# Altium schematic sheet Inverter.SchDoc
size A4
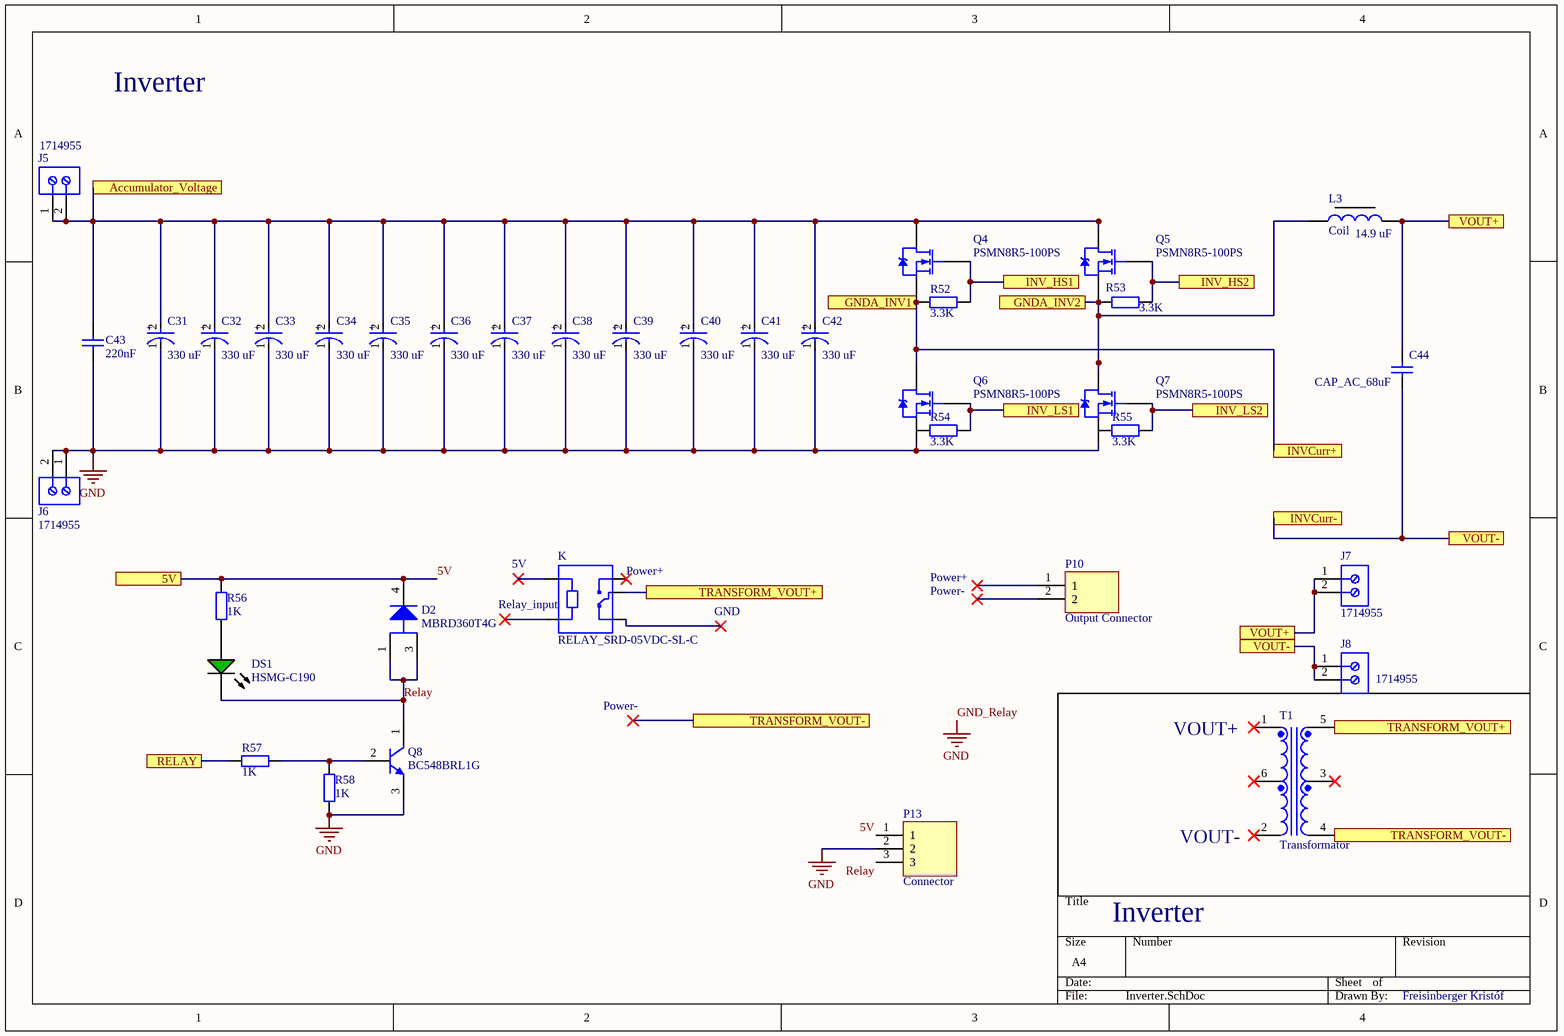
[diagram p0: Inverter.SchDoc]

## Parts
C31  330 uF  [FP-LXW18X25-MFG]
C32  330 uF  [FP-LXW18X25-MFG]
C33  330 uF  [FP-LXW18X25-MFG]
C34  330 uF  [FP-LXW18X25-MFG]
C35  330 uF  [FP-LXW18X25-MFG]
C36  330 uF  [FP-LXW18X25-MFG]
C37  330 uF  [FP-LXW18X25-MFG]
C38  330 uF  [FP-LXW18X25-MFG]
C39  330 uF  [FP-LXW18X25-MFG]
C40  330 uF  [FP-LXW18X25-MFG]
C41  330 uF  [FP-LXW18X25-MFG]
C42  330 uF  [FP-LXW18X25-MFG]
C43  220nF  [FP_0805_CAP_085]
C44  CAP_AC_68uF  [Capacitor_AC_68_uF]
D2  MBRD360T4G  [ONSC-DPAK-3-369C-01_V]
DS1  HSMG-C190  [AVAG-HSMX-C190_V]
J5  1714955  [Terminal-PHOE-1714955_V]
J6  1714955  [Terminal-PHOE-1714955_V]
J7  1714955  [Terminal-PHOE-1714955_V]
J8  1714955  [Terminal-PHOE-1714955_V]
K  RELAY_SRD-05VDC-SL-C  [FP_CONN3_2MM_90]
L3  Coil  value 14.9 uF  [Tekercs_E65_FERRITE]
P10  Output Connector  [FP_CONN2_TAP_254MM]
P13  Connector  [FP_CONN3_TAP_254MM]
Q4  PSMN8R5-100PS  [FP-TO-220AB-MFG]
Q5  PSMN8R5-100PS  [FP-TO-220AB-MFG]
Q6  PSMN8R5-100PS  [FP-TO-220AB-MFG]
Q7  PSMN8R5-100PS  [FP-TO-220AB-MFG]
Q8  BC548BRL1G  [ONSC-TO-92-3-29-11_AM_BL]
R52  3.3K  [FP_0603_RES]
R53  3.3K  [FP_0603_RES]
R54  3.3K  [FP_0603_RES]
R55  3.3K  [FP_0603_RES]
R56  1K  [FP_0603_RES]
R57  1K  [FP_0603_RES]
R58  1K  [FP_0603_RES]
T1  Transformator  [TDK-ALT3232_V]

## Ports
5V, Accumulator_Voltage, GNDA_INV1, GNDA_INV2, INV_HS1, INV_HS2, INV_LS1, INV_LS2, INVCurr+, INVCurr-, RELAY, TRANSFORM_VOUT+, TRANSFORM_VOUT-, VOUT+, VOUT-

## Nets
GND_Relay: C31.1(C) C32.1(C) C33.1(C) C34.1(C) C35.1(C) C36.1(C) C37.1(C) C38.1(C) C39.1(C) C40.1(C) C41.1(C) C42.1(C) C43.1 J6.1 J6.2 P13.2 Q6.3(S) Q7.3(S) Q8.3(E) R58.1  [also labelled GND]
5V: D2.4(K) P13.1 R56.2 ; port 5V
Accumulator_Voltage: C31.2(A) C32.2(A) C33.2(A) C34.2(A) C35.2(A) C36.2(A) C37.2(A) C38.2(A) C39.2(A) C40.2(A) C41.2(A) C42.2(A) C43.2 J5.1 J5.2 Q4.2(D) Q5.2(D) ; port Accumulator_Voltage
GNDA_INV1: Q4.3(S) Q6.2(D) R52.1 ; port INVCurr+, port GNDA_INV1
GNDA_INV2: L3.1(In) Q5.3(S) Q7.2(D) R53.1 ; port GNDA_INV2
INV_HS1: Q4.1(G) R52.2 ; port INV_HS1
INV_HS2: Q5.1(G) R53.2 ; port INV_HS2
INV_LS1: Q6.1(G) R54.2 ; port INV_LS1
INV_LS2: Q7.1(G) R55.2 ; port INV_LS2
INVCurr-: C44.1 J8.1 J8.2 ; port VOUT-, port INVCurr-
Relay: D2.1(A) D2.3(A) DS1.2(K) P13.3 Q8.1(C)
RELAY: R57.1 ; port RELAY  [a separate net that carries the same name]
TRANSFORM_VOUT+: K.COM T1.5 ; port TRANSFORM_VOUT+
TRANSFORM_VOUT-: T1.4 ; port TRANSFORM_VOUT-
VOUT+: C44.2 J7.1 J7.2 L3.2(Out) ; port VOUT+
NetDS1_1: DS1.1(A) R56.1
NetQ8_2: Q8.2(B) R57.2 R58.2

Not connected (* = marked no-connect by the designer): K A1* A2* NC* NO*; P10 1* 2*; R54 1; R55 1; T1 1* 2* 3* 6*

## Notes on the sheet
- Inverter
- (near K) 5V
- (near K) Power+
- Power+
- (near K) Relay_input
- GND
- Power-
- VOUT+
- (near T1) VOUT-
- Freisinberger Kristóf
- (in symbol CMP-35376-000008-1) +

## Library data of the parts
C31-C42 = CMP-35376-000008-1: CAP ALUM 47UF 20% 500V THRUHOLE / 500LXW47MEFR18X25
C43 = CAP: Capacitor; Value: 220nF
C44 = CAP_AC_68uF: Cap Film 68uF 100V PET 10% (31.5 X 22 X 36.5mm) Radial 27.5mm 125C Bulk; Manufacturer: TDK EPCOS; Manufacturer Part Number: B32524Q1686K000; Dielectric Material: Polyester; Lead Diameter: 0.8mm; Supplier 1: Digi-Key; RoHS: Yes; Category: Film Capacitors; Stock 1: 15; Pricing 1: 1=16,57000, 10=15,74200, 50=13,25680, 100=12,42830, 500=11,01972, 1000=10,35688 (USD); Case/Package: Radial; Min Operating Temperature: -55°C; Max Operating Temperature: 125°C; Capacitance: 68uF; Tolerance: 10%; Packaging: Bulk; Dielectric: PET; Voltage Rating (DC): 100V; Voltage Rating: 100V; Length: 31.5mm; Lead Pitch: 27.5mm; Depth: 22mm; REACH SVHC: No SVHC; RoHS Compliant: Yes; ComponentLink1URL: http://www.farnell.com/datasheets/1955213.pdf?src-supplier=Farnell; ComponentLink1Description: http://www.farnell.com/datasheets/1955213.pdf?src-supplier=Farnell; ComponentLink2URL: http://components.arrow.com/part/dataview/0323_01924821?src-supplier=Arrow+Europe; ComponentLink2Description: http://components.arrow.com/part/dataview/0323_01924821?src-supplier=Arrow+Europe; ComponentLink3URL: https://www.tdk-electronics.tdk.com/inf/20/20/db/fc_2009/B32520_529.pdf?src-supplier=Digi-Key; ComponentLink3Description: https://www.tdk-electronics.tdk.com/inf/20/20/db/fc_2009/B32520_529.pdf?src-supplier=Digi-Key; ComponentLink4URL: http://www.farnell.com/datasheets/1955213.pdf?src-supplier=Element14; ComponentLink4Description: http://www.farnell.com/datasheets/1955213.pdf?src-supplier=Element14
D2 = CMP-1055-00192-1: SWITCHMODE(TM) Power Rectifier, 3-Pin DPAK, Pb-Free, Tape and Reel; Manufacturer: On Semiconductor; Configuration: Single; IFSM Max (A): 75; Mounting Technology: Surface Mount; ComponentLink2Description: Datasheet; ComponentLink3URL: http://www.onsemi.cn/pub_link/Collateral/369C.PDF; DatasheetVersion: Rev. 8; ComponentLink2URL: http://www.onsemi.com/pub_link/Collateral/MBRD320-D.PDF; PackageDescription: 3-Pin Flange Mount, Body 6.54 x 6.095 mm, Pitch 2.29 mm; ComponentLink1URL: http://www.onsemi.com/; Packing: Tape and Reel; RoHS: TRUE; ComponentLink1Description: Manufacturer URL; ComponentLink3Description: Package Specification; PackageVersion: Rev. E, 02/2014; PackageReference: DPAK-3-369C-01; PartNumber: MBRD360T4G
DS1 = LED_G_CMP-1744-00002-1_1: Chip LED, Green, 2.2 V, -40 to 85 degC, 2-Pin SMD, RoHS, Tape and Reel; Frequency: 400 KHz; Max Supply Voltage: 5.5 V; Access Time: 3500 ns; Clock Frequency: 100 KHz; Case\Package: SOIC; Density: 32 kb; Nominal Supply Current: 2 mA; Interface: Serial; Min Supply Voltage: 1.7 V; Packaging: Tape and Reel; PackageReference: HSMX-C190; ComponentLink2URL: http://docs.avagotech.com/docs/AV02-0551EN; RoHSCompliant: true; Pins: 8; REACH SVHC: No SVHC; Max Operating Temperature: 85 degC; Width: 4 mm; Radiation Hardening: No; Package Quantity: 3000; ComponentLink3Description: Package Specification; ComponentLink1Description: Manufacturer URL; Min Operating Temperature: -40 degC; PackageDescription: 2-Pin Surface Mount Device, Body 1.6 x 0.8 mm, Height 0.9 mm; Max Clock Frequency: 100 KHz; Height: 1.5 mm; ComponentLink1URL: http://www.avagotech.com/; DatasheetVersion: Mar-12; ComponentLink2Description: Datasheet; Mount: Surface Mount; Length: 5 mm; ComponentLink3URL: http://www.fairchildsemi.com/dwg/MA/MA03D.pdf
J5-J8 = Terminal-CMP-2000-05797-1: PC Terminal Block, Pitch 6.35 mm, 1 x 2 Position, Height 21.5 mm, Tail Lenght 5.1 mm, RoHS, Bulk; Manufacturer: Phoenix Contact; Package Description: PC Terminal Block, Pitch 6.35 mm, 1 x 2 Position, Height 21.5 mm, Tail Lenght 5.1 mm; Datasheet URL: http://media.digikey.com/pdf/Data%20Sheets/Phoenix%20Contact%20PDFs/1714955.pdf; Package Reference: 1714955; Manufacturer URL: http://www.phoenixcontact.com/; Datasheet Version: 02/2010; Mounting Technology: ThroughHole
K = RELAY_SRD-05VDC-SL-C: 5V Trigger Relay Module For Arduino And Raspberry Pi 5V Trigger Relay Module For Arduino And Raspberry Pi; MF: Songle Relay; Package: None; Availability: Unavailable; Value: *; MP: SRD-05VDC-SL-C; SnapEDA_Link: https://www.snapeda.com/parts/SRD-05VDC-SL-C/Songle%20Relay/view-part/1029484/?ref=snap; Price: None
L3 = Tekercs: 14.9 uH inductor; Category: Inductor
P10 = Connector_2pin: 2pin connector
P13 = Connector_3pin: 3pin connector
Q4-Q7 = NMOS-2: N-channel 100 V 8.5 mΩ standard level MOSFET in TO220; Note: Pin 2 is electrically connected to pin 4.; Published: 8-Jun-2000; LatestRevisionDate: 17-Jul-2002; LatestRevisionNote: Re-released for DXP Platform.; DatasheetVersion: PD-9.814; PackageVersion: Feb-1997; PackageReference: TO-220AB; Publisher: Altium Limited; PackageDescription: TO, Thru-Hole, Vertical, Heatsink Mounted; 3 In-Line Leads; Pitch 2.54 mm; ComponentLink1Description: Manufacturer Link; ComponentLink1URL: http://www.irf.com/
Q8 = CMP-1048-01603-1: Amplifier Transistor, NPN Silicon, 3-Pin TO-92, Pb-Free, Tape and Reel; Manufacturer: On Semiconductor; fT Min (MHz): 150; IC Continuous (A): 0.1; ComponentLink3Description: Package Specification; ComponentLink1Description: Manufacturer URL; Packing: Tape and Reel; ComponentLink1URL: http://www.onsemi.com/; PackageReference: TO-92-3-29-11_AM_BL; Polarity: NPN; ComponentLink3URL: http://www.onsemi.com/pub_link/Collateral/MAC97-D.PDF; DatasheetVersion: Rev. 7; PackageDescription: 3-Pin Transistor Outline, Body 4.825 x 3.685 mm, Pitch 1.27 mm; ComponentLink2Description: Datasheet; PartNumber: BC548BRL1G; Mounting Technology: Through Hole; PackageVersion: Rev. AM; RoHS: TRUE; ComponentLink2URL: http://www.onsemi.com/pub_link/Collateral/BC546-D.PDF
R52-R58 = RES: Resistor
  R52-R55: Value: 3.3K
  R56-R58: Value: 1K
T1 = CMP-2000-05771-1: Pulse Transformer for LAN Interface, 2.5 dB, -40 to 85 degC, 6-Pin SMD, RoHS, Tape and Reel; Manufacturer: TDK; Insertion Loss: 2.5dB; Number of Output Ports: 1; Maximum Temperature: +85°C; Minimum Temperature: -40°C; Package Description: 6-Pin Surface Mount Device, Body 3.2 x 3.2 mm; Mounting Technology: SurfaceMount; Datasheet Version: 05/2016; Package Reference: ALT3232; Width: 3.2mm; Manufacturer URL: http://www.tdk.com/; Datasheet URL: https://product.tdk.com/info/en/catalog/datasheets/trans_alt_en.pdf; Length: 3.2mm; Mounting Type: SurfaceMount; Depth: 2.9mm; Dimensions: 3.2x3.2x2.9mm